# Altium schematic sheet [14] - POWER SEQUENCING.SchDoc
size A2; DocumentNumber: 2; SheetNumber: 2; SheetTotal: 4
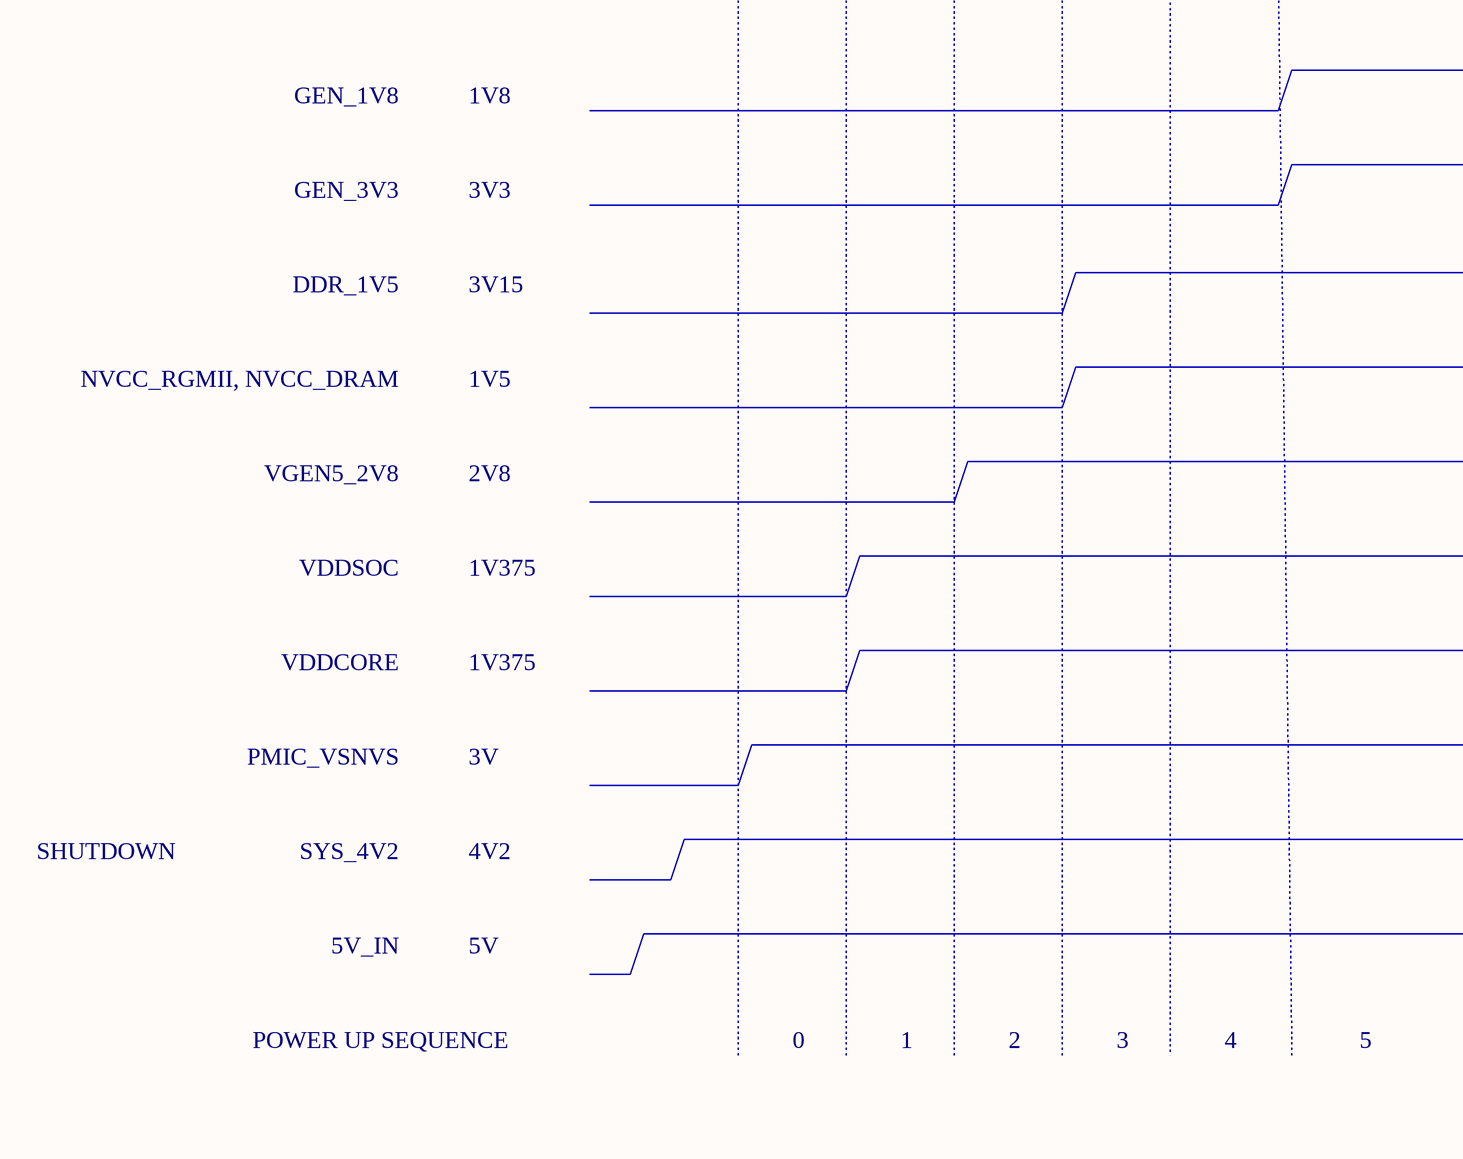
[diagram p0: [14] - POWER SEQUENCING.SchDoc, left]
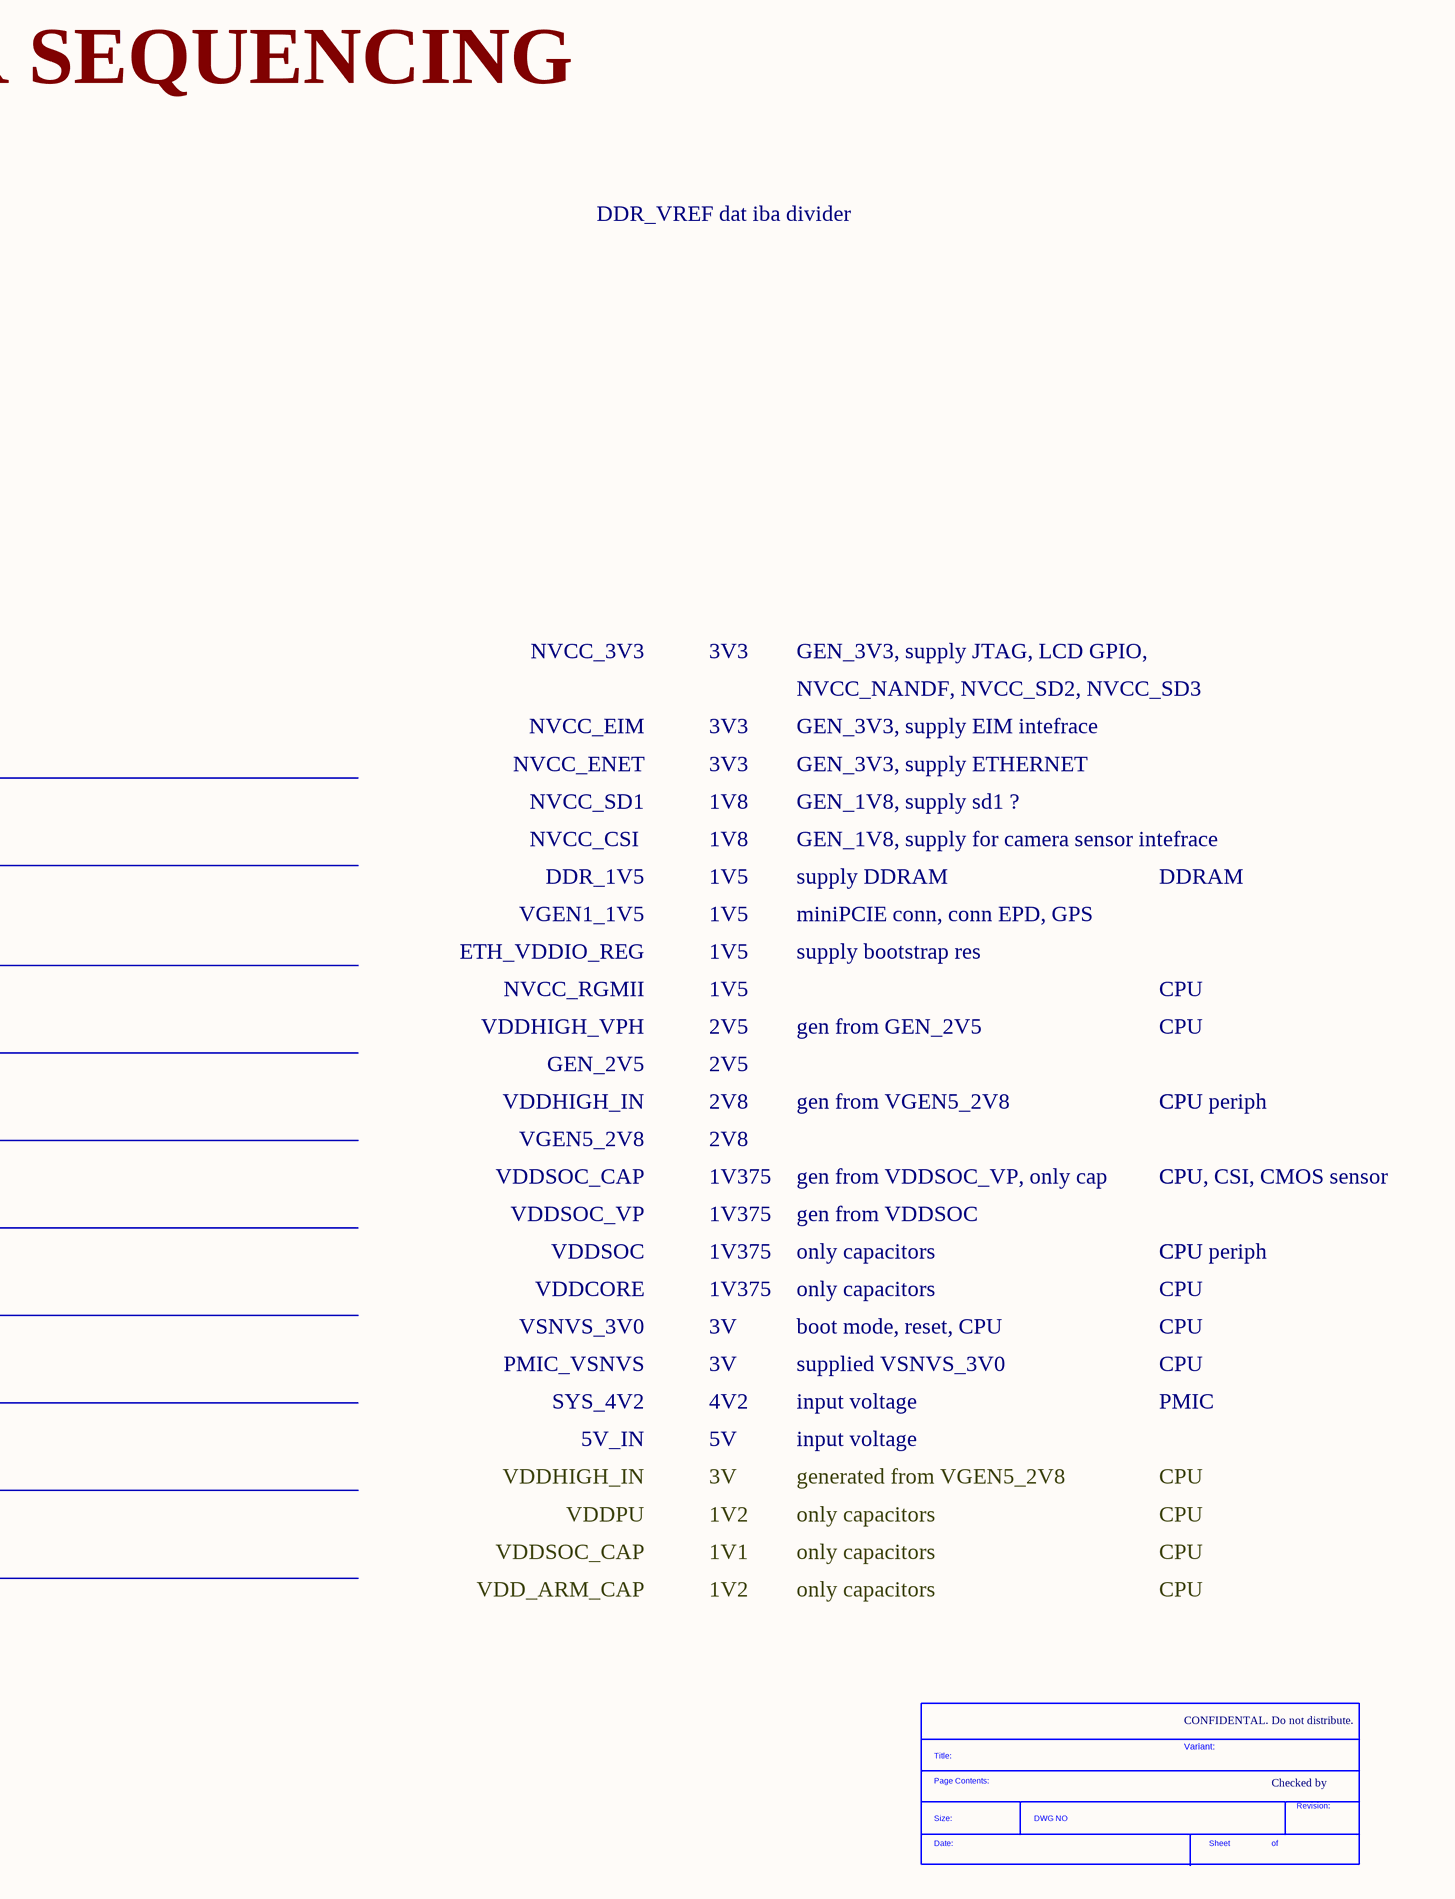
[diagram p1: [14] - POWER SEQUENCING.SchDoc, right]

## Parts
*  SDTitleBlock  (value not drawn)  (graphical)

## Notes on the sheet
- CPU - POWER SEQUENCING
- DDR_VREF dat iba divider
- NVCC_3V3
- 3V3
- GEN_3V3, supply JTAG, LCD GPIO,
- NVCC_EIM
- GEN_3V3, supply EIM intefrace
- NVCC_NANDF, NVCC_SD2, NVCC_SD3
- NVCC_ENET
- GEN_3V3, supply ETHERNET
- GEN_1V8
- 1V8
- NVCC_CSI
- NVCC_SD1
- GEN_1V8, supply for camera sensor intefrace
- GEN_1V8, supply sd1 ?
- GEN_3V3
- VGEN1_1V5
- DDR_1V5
- 1V5
- miniPCIE conn, conn EPD, GPS
- supply DDRAM
- DDRAM
- 3V15
- ETH_VDDIO_REG
- supply bootstrap res
- VDDHIGH_VPH
- NVCC_RGMII
- 2V5
- gen from GEN_2V5
- CPU
- NVCC_RGMII, NVCC_DRAM
- VDDHIGH_IN
- GEN_2V5
- 2V8
- gen from VGEN5_2V8
- CPU periph
- VGEN5_2V8
- VDDSOC_VP
- VDDSOC_CAP
- 1V375
- gen from VDDSOC
- gen from VDDSOC_VP, only cap
- CPU, CSI, CMOS sensor
- VDDSOC
- VDDCORE
- only capacitors
- VSNVS_3V0
- 3V
- boot mode, reset, CPU
- PMIC_VSNVS
- SYS_4V2
- 4V2
- input voltage
- supplied VSNVS_3V0
- PMIC
- 5V_IN
- 5V
- generated from VGEN5_2V8
- SHUTDOWN
- VDDPU
- 1V2
- VDD_ARM_CAP
- 1V1
- POWER UP SEQUENCE
- 0
- 1
- 2
- 3
- 4
- 5
- CONFIDENTAL. Do not distribute.
- Variant:
- Checked by
- (in symbol SDTitleBlock) Title:; Page Contents:; Revision:; Size:; DWG NO; Date:; Sheet; of